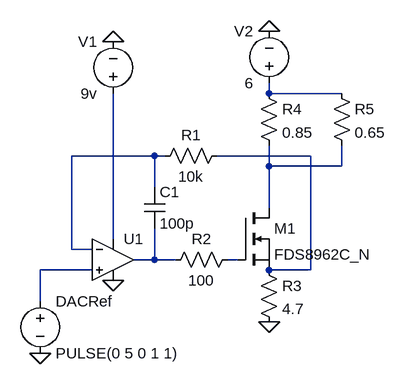
[diagram p0: schematic Current Sink.asc]
Current Sink.asc, the LTspice schematic file:
Version 4
SHEET 1 880 680
WIRE 288 -112 288 -128
WIRE 400 -112 288 -112
WIRE 112 -16 -16 -16
WIRE 128 -16 112 -16
WIRE 352 -16 208 -16
WIRE 288 0 288 -32
WIRE 400 0 400 -32
WIRE 400 0 288 0
WIRE 112 32 112 -16
WIRE 288 64 288 0
WIRE 48 112 48 -112
WIRE -16 128 -16 -16
WIRE 16 128 -16 128
WIRE 112 144 112 96
WIRE 112 144 80 144
WIRE 144 144 112 144
WIRE 240 144 224 144
WIRE 16 160 -64 160
WIRE 352 160 352 -16
WIRE 352 160 288 160
WIRE -64 208 -64 160
FLAG 48 176 0
FLAG 288 240 0
FLAG -64 288 0
FLAG 288 -208 0
FLAG 48 -192 0
SYMBOL OpAmps\\UniversalOpAmp2 48 144 R0
SYMATTR InstName U1
SYMBOL voltage -64 192 R0
WINDOW 123 0 0 Left 0
WINDOW 39 0 0 Left 0
SYMATTR InstName DACRef
SYMATTR Value PULSE(0 5 0 1 1)
SYMBOL voltage 288 -112 R180
WINDOW 0 24 96 Left 2
WINDOW 3 24 16 Left 2
WINDOW 123 0 0 Left 0
WINDOW 39 0 0 Left 0
SYMATTR InstName V2
SYMATTR Value 6
SYMBOL res 272 -128 R0
SYMATTR InstName R4
SYMATTR Value 0.85
SYMBOL res 384 -128 R0
SYMATTR InstName R5
SYMATTR Value 0.65
SYMBOL nmos 240 64 R0
SYMATTR InstName M1
SYMATTR Value FDS8962C_N
SYMBOL res 272 144 R0
SYMATTR InstName R3
SYMATTR Value 4.7
SYMBOL voltage 48 -96 R180
WINDOW 0 24 96 Left 2
WINDOW 3 24 16 Left 2
WINDOW 123 0 0 Left 0
WINDOW 39 0 0 Left 0
SYMATTR InstName V1
SYMATTR Value 9v
SYMBOL res 224 -32 R90
WINDOW 0 0 56 VBottom 2
WINDOW 3 32 56 VTop 2
SYMATTR InstName R1
SYMATTR Value 10k
SYMBOL res 240 128 R90
WINDOW 0 0 56 VBottom 2
WINDOW 3 32 56 VTop 2
SYMATTR InstName R2
SYMATTR Value 100
SYMBOL cap 96 32 R0
SYMATTR InstName C1
SYMATTR Value 100p

The netlist it stands for:
* Current Sink.asc
XU1 N008 N002 N005 0 N006 level2 Avol=1Meg GBW=10Meg Slew=10Meg Ilimit=25m Rail=0 Vos=0 En=0 Enk=0 In=0 Ink=0 Rin=500Meg  ; pins In+ In- V+ V- OUT
V§DACRef N008 0 PULSE(0 5 0 1 1)
V2 N001 0 6
R4 N001 N004 0.85
R5 N001 N004 0.65
M1 N004 N007 N003 N003 FDS8962C_N
R3 N003 0 4.7
V1 N005 0 9v
R1 N003 N002 10k
R2 N007 N006 100
C1 N002 N006 100p
.model NMOS NMOS
.model PMOS PMOS
.lib standard.mos
.lib UniversalOpAmp2.lib
.backanno
.end